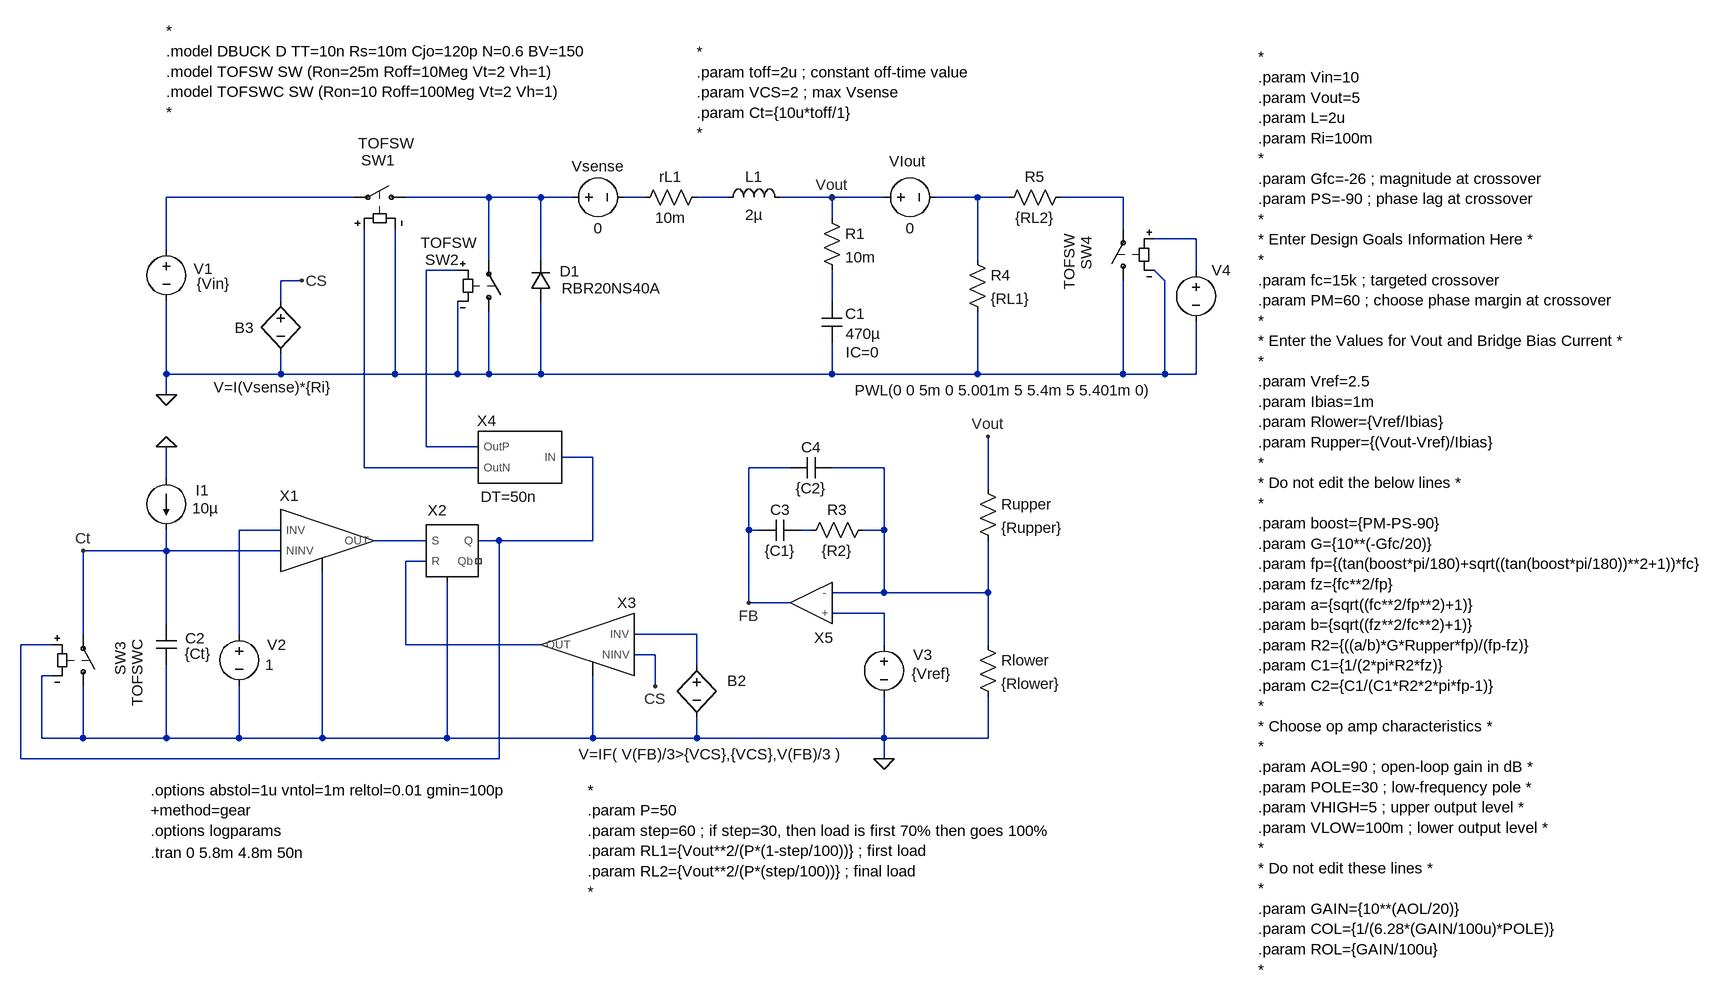
[diagram p0: schematic Buck FOT - load step.asc]
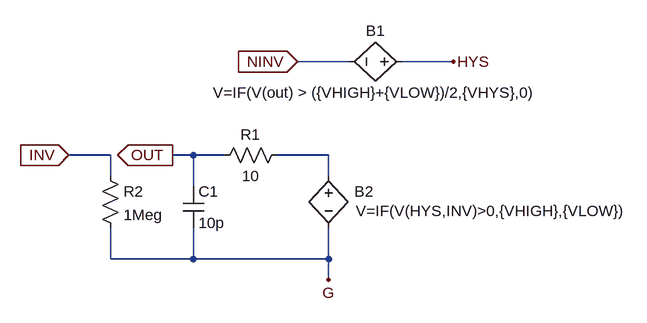
[diagram p1: sub-circuit comptof_g.asc]
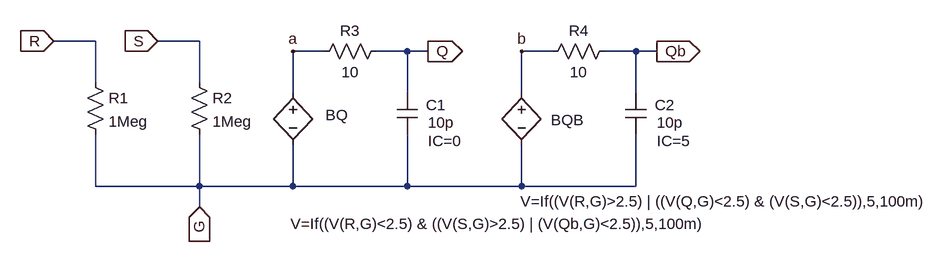
[diagram p2: sub-circuit sr_latch_g.asc]
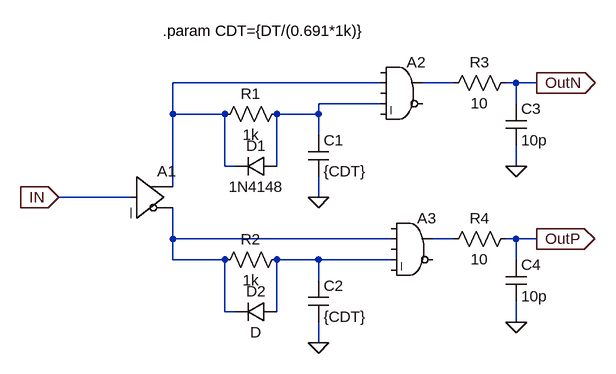
[diagram p3: sub-circuit dt_driver.asc]
Buck FOT - load step.asc, the LTspice schematic file:
Version 4.1
SHEET 1 2264 2468
WIRE -160 80 -448 80
WIRE 48 80 -80 80
WIRE 128 80 48 80
WIRE 176 80 128 80
WIRE 288 80 256 80
WIRE 416 80 368 80
WIRE 576 80 496 80
WIRE 656 80 576 80
WIRE 800 80 736 80
WIRE 848 80 800 80
WIRE 1024 80 928 80
WIRE 576 112 576 80
WIRE 1024 128 1024 80
WIRE 1136 144 1072 144
WIRE -448 160 -448 80
WIRE 48 176 48 80
WIRE 128 176 128 80
WIRE 800 176 800 80
WIRE 0 192 -48 192
WIRE 1136 192 1136 144
WIRE -240 208 -272 208
WIRE 1088 208 1072 192
WIRE -272 240 -272 208
WIRE 576 240 576 192
WIRE -448 352 -448 240
WIRE -272 352 -272 320
WIRE -272 352 -448 352
WIRE -96 352 -96 128
WIRE -96 352 -272 352
WIRE 0 352 0 240
WIRE 0 352 -96 352
WIRE 48 352 48 256
WIRE 48 352 0 352
WIRE 128 352 128 240
WIRE 128 352 48 352
WIRE 576 352 576 304
WIRE 576 352 128 352
WIRE 800 352 800 256
WIRE 800 352 576 352
WIRE 1024 352 1024 208
WIRE 1024 352 800 352
WIRE 1088 352 1088 208
WIRE 1088 352 1024 352
WIRE 1136 352 1136 272
WIRE 1136 352 1088 352
WIRE -448 384 -448 352
WIRE -48 464 -48 192
WIRE 32 464 -48 464
WIRE 208 480 160 480
WIRE -144 496 -144 128
WIRE 32 496 -144 496
WIRE 512 496 448 496
WIRE 656 496 576 496
WIRE -448 512 -448 464
WIRE 816 528 816 448
WIRE -272 592 -336 592
WIRE 448 592 448 496
WIRE 464 592 448 592
WIRE 544 592 528 592
WIRE 656 592 656 496
WIRE 656 592 624 592
WIRE -48 608 -128 608
WIRE 64 608 32 608
WIRE 208 608 208 480
WIRE 208 608 64 608
WIRE -448 624 -448 592
WIRE -448 624 -576 624
WIRE -272 624 -448 624
WIRE -48 640 -80 640
WIRE 656 688 656 592
WIRE 656 688 576 688
WIRE 816 688 816 608
WIRE 816 688 656 688
WIRE 448 704 448 592
WIRE 512 704 448 704
WIRE 656 720 576 720
WIRE -448 736 -448 624
WIRE -576 752 -576 624
WIRE -336 752 -336 592
WIRE 368 752 272 752
WIRE -624 768 -672 768
WIRE -80 768 -80 640
WIRE 128 768 -80 768
WIRE 656 768 656 720
WIRE 816 768 816 688
WIRE 304 784 272 784
WIRE 368 800 368 752
WIRE -624 816 -640 816
WIRE 304 832 304 784
WIRE -640 912 -640 816
WIRE -576 912 -576 832
WIRE -576 912 -640 912
WIRE -448 912 -448 800
WIRE -448 912 -576 912
WIRE -336 912 -336 832
WIRE -336 912 -448 912
WIRE -208 912 -208 656
WIRE -208 912 -336 912
WIRE -16 912 -16 672
WIRE -16 912 -208 912
WIRE 208 912 208 816
WIRE 208 912 -16 912
WIRE 368 912 368 880
WIRE 368 912 208 912
WIRE 656 912 656 848
WIRE 656 912 368 912
WIRE 816 912 816 848
WIRE 816 912 656 912
WIRE -672 944 -672 768
WIRE 64 944 64 608
WIRE 64 944 -672 944
WIRE 656 944 656 912
FLAG -448 384 0
FLAG -240 208 CS
FLAG 576 80 Vout
FLAG -448 464 0
FLAG 304 832 CS
FLAG 656 944 0
FLAG 816 448 Vout
FLAG -576 624 Ct
FLAG 448 704 FB
SYMBOL sw -64 80 M270
WINDOW 3 83 89 VLeft 2
WINDOW 0 57 84 VLeft 2
SYMATTR Value TOFSW
SYMATTR InstName SW1
SYMBOL voltage 160 80 R270
WINDOW 0 32 56 VTop 2
WINDOW 3 -32 56 VBottom 2
SYMATTR InstName Vsense
SYMATTR Value 0
SYMBOL voltage -448 144 R0
WINDOW 0 42 46 Left 2
WINDOW 3 47 69 Left 2
SYMATTR InstName V1
SYMATTR Value {Vin}
SYMBOL diode 144 240 R180
WINDOW 0 -44 46 Left 2
WINDOW 3 -169 20 Left 2
SYMATTR InstName D1
SYMATTR Value RBR20NS40A
SYMBOL res 384 64 R90
WINDOW 0 0 56 VBottom 2
WINDOW 3 32 56 VTop 2
SYMATTR InstName rL1
SYMATTR Value 10m
SYMBOL ind 400 96 R270
WINDOW 0 32 56 VTop 2
WINDOW 3 5 56 VBottom 2
SYMATTR InstName L1
SYMATTR Value 2µ
SYMBOL res 560 96 R0
SYMATTR InstName R1
SYMATTR Value 10m
SYMBOL cap 560 240 R0
WINDOW 0 36 19 Left 2
WINDOW 3 37 50 Left 2
WINDOW 123 37 78 Left 2
SYMATTR InstName C1
SYMATTR Value 470µ
SYMATTR Value2 IC=0
SYMBOL voltage 640 80 R270
WINDOW 0 40 52 VTop 2
WINDOW 3 -32 56 VBottom 2
SYMATTR InstName VIout
SYMATTR Value 0
SYMBOL sw 48 272 M180
WINDOW 3 -18 122 Right 2
WINDOW 0 -46 96 Right 2
SYMATTR Value TOFSW
SYMATTR InstName SW2
SYMBOL current -448 512 R0
WINDOW 0 45 19 Left 2
WINDOW 3 40 46 Left 2
SYMATTR InstName I1
SYMATTR Value 10µ
SYMBOL cap -464 736 R0
WINDOW 0 45 22 Left 2
WINDOW 3 44 46 Left 2
SYMATTR InstName C2
SYMATTR Value {Ct}
SYMATTR SpiceLine IC=0
SYMBOL voltage -336 736 R0
WINDOW 0 43 32 Left 2
WINDOW 3 40 63 Left 2
SYMATTR InstName V2
SYMATTR Value 1
SYMBOL TOF\\Subcircuits\\COMPTOF_G -208 608 R0
WINDOW 0 -51 -53 Bottom 2
SYMATTR InstName X1
SYMATTR SpiceLine VHIGH=5 VLOW=100m VHYS=10m
SYMBOL sw -576 848 M180
WINDOW 3 83 89 VLeft 2
WINDOW 0 57 84 VLeft 2
SYMATTR Value TOFSWC
SYMATTR InstName SW3
SYMBOL TOF\\Subcircuits\\SR_latch_G -16 624 R0
WINDOW 0 -15 -47 Bottom 2
SYMATTR InstName X2
SYMBOL TOF\\Subcircuits\\COMPTOF_G 208 768 M0
WINDOW 0 -52 -49 Bottom 2
SYMATTR InstName X3
SYMATTR SpiceLine VHIGH=5 VLOW=100m VHYS=10m
SYMBOL bv 368 784 R0
WINDOW 0 47 40 Left 2
WINDOW 3 -182 153 Left 2
SYMATTR InstName B2
SYMATTR Value V=IF( V(FB)/3>{VCS},{VCS},V(FB)/3 )
SYMBOL res 800 752 R0
SYMATTR InstName Rlower
SYMATTR Value {Rlower}
SYMBOL res 800 512 R0
SYMATTR InstName Rupper
SYMATTR Value {Rupper}
SYMBOL voltage 656 752 R0
WINDOW 0 45 32 Left 2
WINDOW 3 43 61 Left 2
WINDOW 123 0 0 Left 0
WINDOW 39 0 0 Left 0
SYMATTR InstName V3
SYMATTR Value {Vref}
SYMBOL cap 528 576 R90
WINDOW 0 0 32 VBottom 2
WINDOW 3 32 32 VTop 2
SYMATTR InstName C3
SYMATTR Value {C1}
SYMBOL res 640 576 R90
WINDOW 0 0 56 VBottom 2
WINDOW 3 32 56 VTop 2
SYMATTR InstName R3
SYMATTR Value {R2}
SYMBOL cap 576 480 R90
WINDOW 0 0 32 VBottom 2
WINDOW 3 32 32 VTop 2
SYMATTR InstName C4
SYMATTR Value {C2}
SYMBOL TOF\\Subcircuits\\opampTOF 512 688 M0
WINDOW 0 -51 85 Bottom 2
SYMATTR InstName X5
SYMATTR SpiceLine Vhigh={VHIGH} Vlow={VLOW} Col={COL} Rol={ROL}
SYMBOL bv -272 224 R0
WINDOW 0 -71 57 Left 2
WINDOW 3 -103 148 Left 2
SYMATTR InstName B3
SYMATTR Value V=I(Vsense)*{Ri}
SYMBOL TOF\\Subcircuits\\DT_driver 96 480 R180
WINDOW 0 51 72 Bottom 2
WINDOW 39 17 -45 Bottom 2
SYMATTR InstName X4
SYMATTR SpiceLine DT=50n
SYMBOL res 784 160 R0
SYMATTR InstName R4
SYMATTR Value {RL1}
SYMBOL res 944 64 R90
WINDOW 0 0 56 VBottom 2
WINDOW 3 32 56 VTop 2
SYMATTR InstName R5
SYMATTR Value {RL2}
SYMBOL sw 1024 224 R180
WINDOW 3 83 89 VLeft 2
WINDOW 0 57 84 VLeft 2
SYMATTR Value TOFSW
SYMATTR InstName SW4
SYMBOL voltage 1136 176 R0
WINDOW 3 -525 201 Left 2
WINDOW 123 0 0 Left 0
WINDOW 39 0 0 Left 0
SYMATTR Value PWL(0 0 5m 0 5.001m 5 5.4m 5 5.401m 0)
SYMATTR InstName V4
TEXT -448 -176 Left 2 !*\n.model DBUCK D TT=10n Rs=10m Cjo=120p N=0.6 BV=150\n.model TOFSW SW (Ron=25m Roff=10Meg Vt=2 Vh=1)\n.model TOFSWC SW (Ron=10 Roff=100Meg Vt=2 Vh=1)\n*
TEXT 368 -144 Left 2 !*\n.param toff=2u ; constant off-time value\n.param VCS=2 ; max Vsense\n.param Ct={10u*toff/1}\n*
TEXT 1232 -136 Left 2 !*\n.param Vin=10\n.param Vout=5\n.param L=2u\n.param Ri=100m\n*\n.param Gfc=-26 ; magnitude at crossover\n.param PS=-90 ; phase lag at crossover\n*\n* Enter Design Goals Information Here *\n*\n.param fc=15k ; targeted crossover\n.param PM=60 ; choose phase margin at crossover\n*\n* Enter the Values for Vout and Bridge Bias Current *\n*\n.param Vref=2.5\n.param Ibias=1m\n.param Rlower={Vref/Ibias}\n.param Rupper={(Vout-Vref)/Ibias}\n*\n* Do not edit the below lines *\n*\n.param boost={PM-PS-90}\n.param G={10**(-Gfc/20)}\n.param fp={(tan(boost*pi/180)+sqrt((tan(boost*pi/180))**2+1))*fc}\n.param fz={fc**2/fp}\n.param a={sqrt((fc**2/fp**2)+1)}\n.param b={sqrt((fz**2/fc**2)+1)}\n.param R2={((a/b)*G*Rupper*fp)/(fp-fz)}\n.param C1={1/(2*pi*R2*fz)}\n.param C2={C1/(C1*R2*2*pi*fp-1)}\n*\n* Choose op amp characteristics *\n*\n.param AOL=90 ; open-loop gain in dB *\n.param POLE=30 ; low-frequency pole *\n.param VHIGH=5 ; upper output level *\n.param VLOW=100m ; lower output level *\n*\n* Do not edit these lines *\n*\n.param GAIN={10**(AOL/20)}\n.param COL={1/(6.28*(GAIN/100u)*POLE)}\n.param ROL={GAIN/100u}\n*
TEXT -472 992 Left 2 !.options abstol=1u vntol=1m reltol=0.01 gmin=100p\n+method=gear\n.options logparams
TEXT -472 1088 Left 2 !.tran 0 5.8m 4.8m 50n
TEXT 200 992 Left 2 !*\n.param P=50\n.param step=60 ; if step=30, then load is first 70% then goes 100%\n.param RL1={Vout**2/(P*(1-step/100))} ; first load\n.param RL2={Vout**2/(P*(step/100))} ; final load\n*

comptof_g.asc, the sub-circuit schematic file:
Version 4.1
SHEET 1 880 680
WIRE 64 192 -16 192
WIRE 224 192 144 192
WIRE -304 336 -368 336
WIRE -176 336 -208 336
WIRE -128 336 -176 336
WIRE 32 336 -48 336
WIRE -304 368 -304 336
WIRE 32 368 32 336
WIRE -176 384 -176 336
WIRE -304 496 -304 448
WIRE -176 496 -176 448
WIRE -176 496 -304 496
WIRE 32 496 32 448
WIRE 32 496 -176 496
WIRE 32 528 32 496
FLAG -16 192 NINV
IOPIN -16 192 In
FLAG 224 192 HYS
FLAG -208 336 OUT
IOPIN -208 336 Out
FLAG -368 336 INV
IOPIN -368 336 In
FLAG 32 528 G
SYMBOL bv 160 192 R90
WINDOW 0 -32 56 VBottom 2
WINDOW 3 32 56 VTop 2
SYMATTR InstName B1
SYMATTR Value V=IF(V(out) > ({VHIGH}+{VLOW})/2,{VHYS},0)
SYMBOL bv 32 352 R0
WINDOW 0 40 40 Left 2
WINDOW 3 42 70 Left 2
SYMATTR InstName B2
SYMATTR Value V=IF(V(HYS,INV)>0,{VHIGH},{VLOW})
SYMBOL res -32 320 R90
WINDOW 0 0 56 VBottom 2
WINDOW 3 32 56 VTop 2
SYMATTR InstName R1
SYMATTR Value 10
SYMBOL cap -192 384 R0
SYMATTR InstName C1
SYMATTR Value 10p
SYMBOL res -320 352 R0
SYMATTR InstName R2
SYMATTR Value 1Meg

sr_latch_g.asc, the sub-circuit schematic file:
Version 4.1
SHEET 1 1168 680
WIRE -192 48 -256 48
WIRE -32 48 -96 48
WIRE 160 64 112 64
WIRE 288 64 240 64
WIRE 320 64 288 64
WIRE 512 64 464 64
WIRE 640 64 592 64
WIRE 672 64 640 64
WIRE -192 112 -192 48
WIRE -32 112 -32 48
WIRE 112 128 112 64
WIRE 288 128 288 64
WIRE 464 128 464 64
WIRE 640 128 640 64
WIRE -192 272 -192 192
WIRE -32 272 -32 192
WIRE -32 272 -192 272
WIRE 112 272 112 208
WIRE 112 272 -32 272
WIRE 288 272 288 192
WIRE 288 272 112 272
WIRE 464 272 464 208
WIRE 464 272 288 272
WIRE 640 272 640 192
WIRE 640 272 464 272
WIRE -32 304 -32 272
FLAG -256 48 R
IOPIN -256 48 In
FLAG -96 48 S
IOPIN -96 48 In
FLAG 320 64 Q
IOPIN 320 64 Out
FLAG 672 64 Qb
IOPIN 672 64 Out
FLAG 112 64 a
FLAG 464 64 b
FLAG -32 304 G
IOPIN -32 304 In
SYMBOL bv 112 112 R0
WINDOW 0 50 50 Left 2
WINDOW 3 -4 218 Left 2
SYMATTR InstName BQ
SYMATTR Value V=If((V(R,G)<2.5) & ((V(S,G)>2.5) | (V(Qb,G)<2.5)),5,100m)
SYMBOL res -208 96 R0
SYMATTR InstName R1
SYMATTR Value 1Meg
SYMBOL res -48 96 R0
SYMATTR InstName R2
SYMATTR Value 1Meg
SYMBOL res 256 48 R90
WINDOW 0 0 56 VBottom 2
WINDOW 3 32 56 VTop 2
SYMATTR InstName R3
SYMATTR Value 10
SYMBOL cap 272 128 R0
WINDOW 0 45 19 Left 2
WINDOW 3 48 46 Left 2
WINDOW 123 48 74 Left 2
SYMATTR InstName C1
SYMATTR Value 10p
SYMATTR Value2 IC=0
SYMBOL bv 464 112 R0
WINDOW 0 45 58 Left 2
WINDOW 3 -2 183 Left 2
SYMATTR InstName BQB
SYMATTR Value V=If((V(R,G)>2.5) | ((V(Q,G)<2.5) & (V(S,G)<2.5)),5,100m)
SYMBOL res 608 48 R90
WINDOW 0 0 56 VBottom 2
WINDOW 3 32 56 VTop 2
SYMATTR InstName R4
SYMATTR Value 10
SYMBOL cap 624 128 R0
WINDOW 0 45 19 Left 2
WINDOW 3 48 46 Left 2
WINDOW 123 48 74 Left 2
SYMATTR InstName C2
SYMATTR Value 10p
SYMATTR Value2 IC=5

dt_driver.asc, the sub-circuit schematic file:
Version 4
SHEET 1 880 680
WIRE 480 32 160 32
WIRE 592 32 544 32
WIRE 688 32 672 32
WIRE 720 32 688 32
WIRE 480 64 384 64
WIRE 688 64 688 32
WIRE 160 80 160 32
WIRE 240 80 160 80
WIRE 384 80 384 64
WIRE 384 80 320 80
WIRE 384 112 384 80
WIRE 240 160 240 80
WIRE 256 160 240 160
WIRE 320 160 320 80
WIRE 688 160 688 128
WIRE 160 192 160 80
WIRE 96 208 -16 208
WIRE 384 208 384 176
WIRE 160 272 160 224
WIRE 496 272 160 272
WIRE 592 272 560 272
WIRE 688 272 672 272
WIRE 720 272 688 272
WIRE 160 304 160 272
WIRE 240 304 160 304
WIRE 384 304 320 304
WIRE 496 304 384 304
WIRE 688 304 688 272
WIRE 384 336 384 304
WIRE 240 384 240 304
WIRE 256 384 240 384
WIRE 320 384 320 304
WIRE 688 400 688 368
WIRE 384 432 384 400
FLAG 384 208 0
FLAG 384 432 0
FLAG 720 32 OutN
IOPIN 720 32 Out
FLAG 720 272 OutP
IOPIN 720 272 Out
FLAG -16 208 IN
IOPIN -16 208 In
FLAG 688 160 0
FLAG 688 400 0
SYMBOL Digital\\buf 96 144 R0
SYMATTR InstName A1
SYMATTR SpiceLine Vhigh=5 Vlow=0 Ref=1.0
SYMBOL res 336 64 R90
WINDOW 0 0 56 VBottom 2
WINDOW 3 32 56 VTop 2
SYMATTR InstName R1
SYMATTR Value 1k
SYMBOL cap 368 112 R0
SYMATTR InstName C1
SYMATTR Value {CDT}
SYMBOL res 336 288 R90
WINDOW 0 0 56 VBottom 2
WINDOW 3 32 56 VTop 2
SYMATTR InstName R2
SYMATTR Value 1k
SYMBOL cap 368 336 R0
SYMATTR InstName C2
SYMATTR Value {CDT}
SYMBOL Digital\\and 512 -16 R0
SYMATTR InstName A2
SYMATTR SpiceLine Vhigh=5 Vlow=0 Ref=2.5
SYMBOL Digital\\and 528 224 R0
SYMATTR InstName A3
SYMATTR SpiceLine Vhigh=5 Vlow=0 Ref=2.5
SYMBOL diode 320 144 R90
WINDOW 0 0 32 VBottom 2
WINDOW 3 32 32 VTop 2
SYMATTR InstName D1
SYMATTR Value 1N4148
SYMBOL diode 320 368 R90
WINDOW 0 0 32 VBottom 2
WINDOW 3 32 32 VTop 2
SYMATTR InstName D2
SYMBOL res 688 16 R90
WINDOW 0 0 56 VBottom 2
WINDOW 3 32 56 VTop 2
SYMATTR InstName R3
SYMATTR Value 10
SYMBOL res 688 256 R90
WINDOW 0 0 56 VBottom 2
WINDOW 3 32 56 VTop 2
SYMATTR InstName R4
SYMATTR Value 10
SYMBOL cap 672 64 R0
SYMATTR InstName C3
SYMATTR Value 10p
SYMBOL cap 672 304 R0
SYMATTR InstName C4
SYMATTR Value 10p
TEXT 144 -48 Left 2 !.param CDT={DT/(0.691*1k)}

The netlist it stands for:
* Buck FOT - load step.asc
SW1 N002 N001 N011 0 TOFSW
Vsense N002 N003 0
V1 N001 0 {Vin}
D1 0 N002 RBR20NS40A
rL1 N004 N003 10m
L1 N004 Vout 2µ
R1 Vout N009 10m
C1 N009 0 470µ IC=0
VIout Vout N005 0
SW2 0 N002 N008 0 TOFSW
I1 0 Ct 10µ
C2 Ct 0 {Ct} IC=0
V2 N013 0 1
X§X1 N013 Ct N015 0 comptof_g params: VHIGH=5 VLOW=100m VHYS=10m
SW3 0 Ct N010 0 TOFSWC
X§X2 N016 N015 N010 NC_01 0 sr_latch_g
X§X3 N018 CS N016 0 comptof_g params: VHIGH=5 VLOW=100m VHYS=10m
B2 N018 0 V=IF( V(FB)/3>{VCS},{VCS},V(FB)/3 )
Rlower N012 0 {Rlower}
Rupper Vout N012 {Rupper}
V3 N017 0 {Vref}
C3 N014 FB {C1}
R3 N012 N014 {R2}
C4 N012 FB {C2}
X§X5 N012 N017 FB opampTOF params: Vhigh={VHIGH} Vlow={VLOW} Col={COL} Rol={ROL}  ; pins - + OUT
B3 CS 0 V=I(Vsense)*{Ri}
X§X4 N010 N011 N008 dt_driver params: DT=50n
R4 N005 0 {RL1}
R5 N006 N005 {RL2}
SW4 0 N006 N007 0 TOFSW
V4 N007 0 PWL(0 0 5m 0 5.001m 5 5.4m 5 5.401m 0)

* block symbol definitions
.subckt comptof_g INV NINV OUT G
B1 HYS NINV V=IF(V(out) > ({VHIGH}+{VLOW})/2,{VHYS},0)
B2 N001 G V=IF(V(HYS,INV)>0,{VHIGH},{VLOW})
R1 N001 OUT 10
C1 OUT G 10p
R2 INV G 1Meg
.ends comptof_g

.subckt sr_latch_g R S Q Qb G
BQ a G V=If((V(R,G)<2.5) & ((V(S,G)>2.5) | (V(Qb,G)<2.5)),5,100m)
R1 R G 1Meg
R2 S G 1Meg
R3 Q a 10
C1 Q G 10p IC=0
BQB b G V=If((V(R,G)>2.5) | ((V(Q,G)<2.5) & (V(S,G)<2.5)),5,100m)
R4 Qb b 10
C2 Qb G 10p IC=5
.ends sr_latch_g

.subckt dt_driver IN OutN OutP
A1 IN 0 0 0 0 N004 N001 0 BUF Vhigh=5 Vlow=0 Ref=1.0
R1 N003 N001 1k
C1 N003 0 {CDT}
R2 N006 N004 1k
C2 N006 0 {CDT}
A2 0 N001 0 N003 0 0 N002 0 AND Vhigh=5 Vlow=0 Ref=2.5
A3 0 N004 0 N006 0 0 N005 0 AND Vhigh=5 Vlow=0 Ref=2.5
D1 N003 N001 1N4148
D2 N006 N004 D
R3 OutN N002 10
R4 OutP N005 10
C3 OutN 0 10p
C4 OutP 0 10p
.param CDT={DT/(0.691*1k)}
.ends dt_driver

.model D D
.lib standard.dio
*
.model DBUCK D TT=10n Rs=10m Cjo=120p N=0.6 BV=150
.model TOFSW SW (Ron=25m Roff=10Meg Vt=2 Vh=1)
.model TOFSWC SW (Ron=10 Roff=100Meg Vt=2 Vh=1)
*
*
.param toff=2u ; constant off-time value
.param VCS=2 ; max Vsense
.param Ct={10u*toff/1}
*
*
.param Vin=10
.param Vout=5
.param L=2u
.param Ri=100m
*
.param Gfc=-26 ; magnitude at crossover
.param PS=-90 ; phase lag at crossover
*
* Enter Design Goals Information Here *
*
.param fc=15k ; targeted crossover
.param PM=60 ; choose phase margin at crossover
*
* Enter the Values for Vout and Bridge Bias Current *
*
.param Vref=2.5
.param Ibias=1m
.param Rlower={Vref/Ibias}
.param Rupper={(Vout-Vref)/Ibias}
*
* Do not edit the below lines *
*
.param boost={PM-PS-90}
.param G={10**(-Gfc/20)}
.param fp={(tan(boost*pi/180)+sqrt((tan(boost*pi/180))**2+1))*fc}
.param fz={fc**2/fp}
.param a={sqrt((fc**2/fp**2)+1)}
.param b={sqrt((fz**2/fc**2)+1)}
.param R2={((a/b)*G*Rupper*fp)/(fp-fz)}
.param C1={1/(2*pi*R2*fz)}
.param C2={C1/(C1*R2*2*pi*fp-1)}
*
* Choose op amp characteristics *
*
.param AOL=90 ; open-loop gain in dB *
.param POLE=30 ; low-frequency pole *
.param VHIGH=5 ; upper output level *
.param VLOW=100m ; lower output level *
*
* Do not edit these lines *
*
.param GAIN={10**(AOL/20)}
.param COL={1/(6.28*(GAIN/100u)*POLE)}
.param ROL={GAIN/100u}
*
.options abstol=1u vntol=1m reltol=0.01 gmin=100p
+method=gear
.options logparams
.tran 0 5.8m 4.8m 50n
*
.param P=50
.param step=60 ; if step=30, then load is first 70% then goes 100%
.param RL1={Vout**2/(P*(1-step/100))} ; first load
.param RL2={Vout**2/(P*(step/100))} ; final load
*
.backanno
.end